# EAGLE design LM723 voltage regulator (EAGLE 9.4.2)
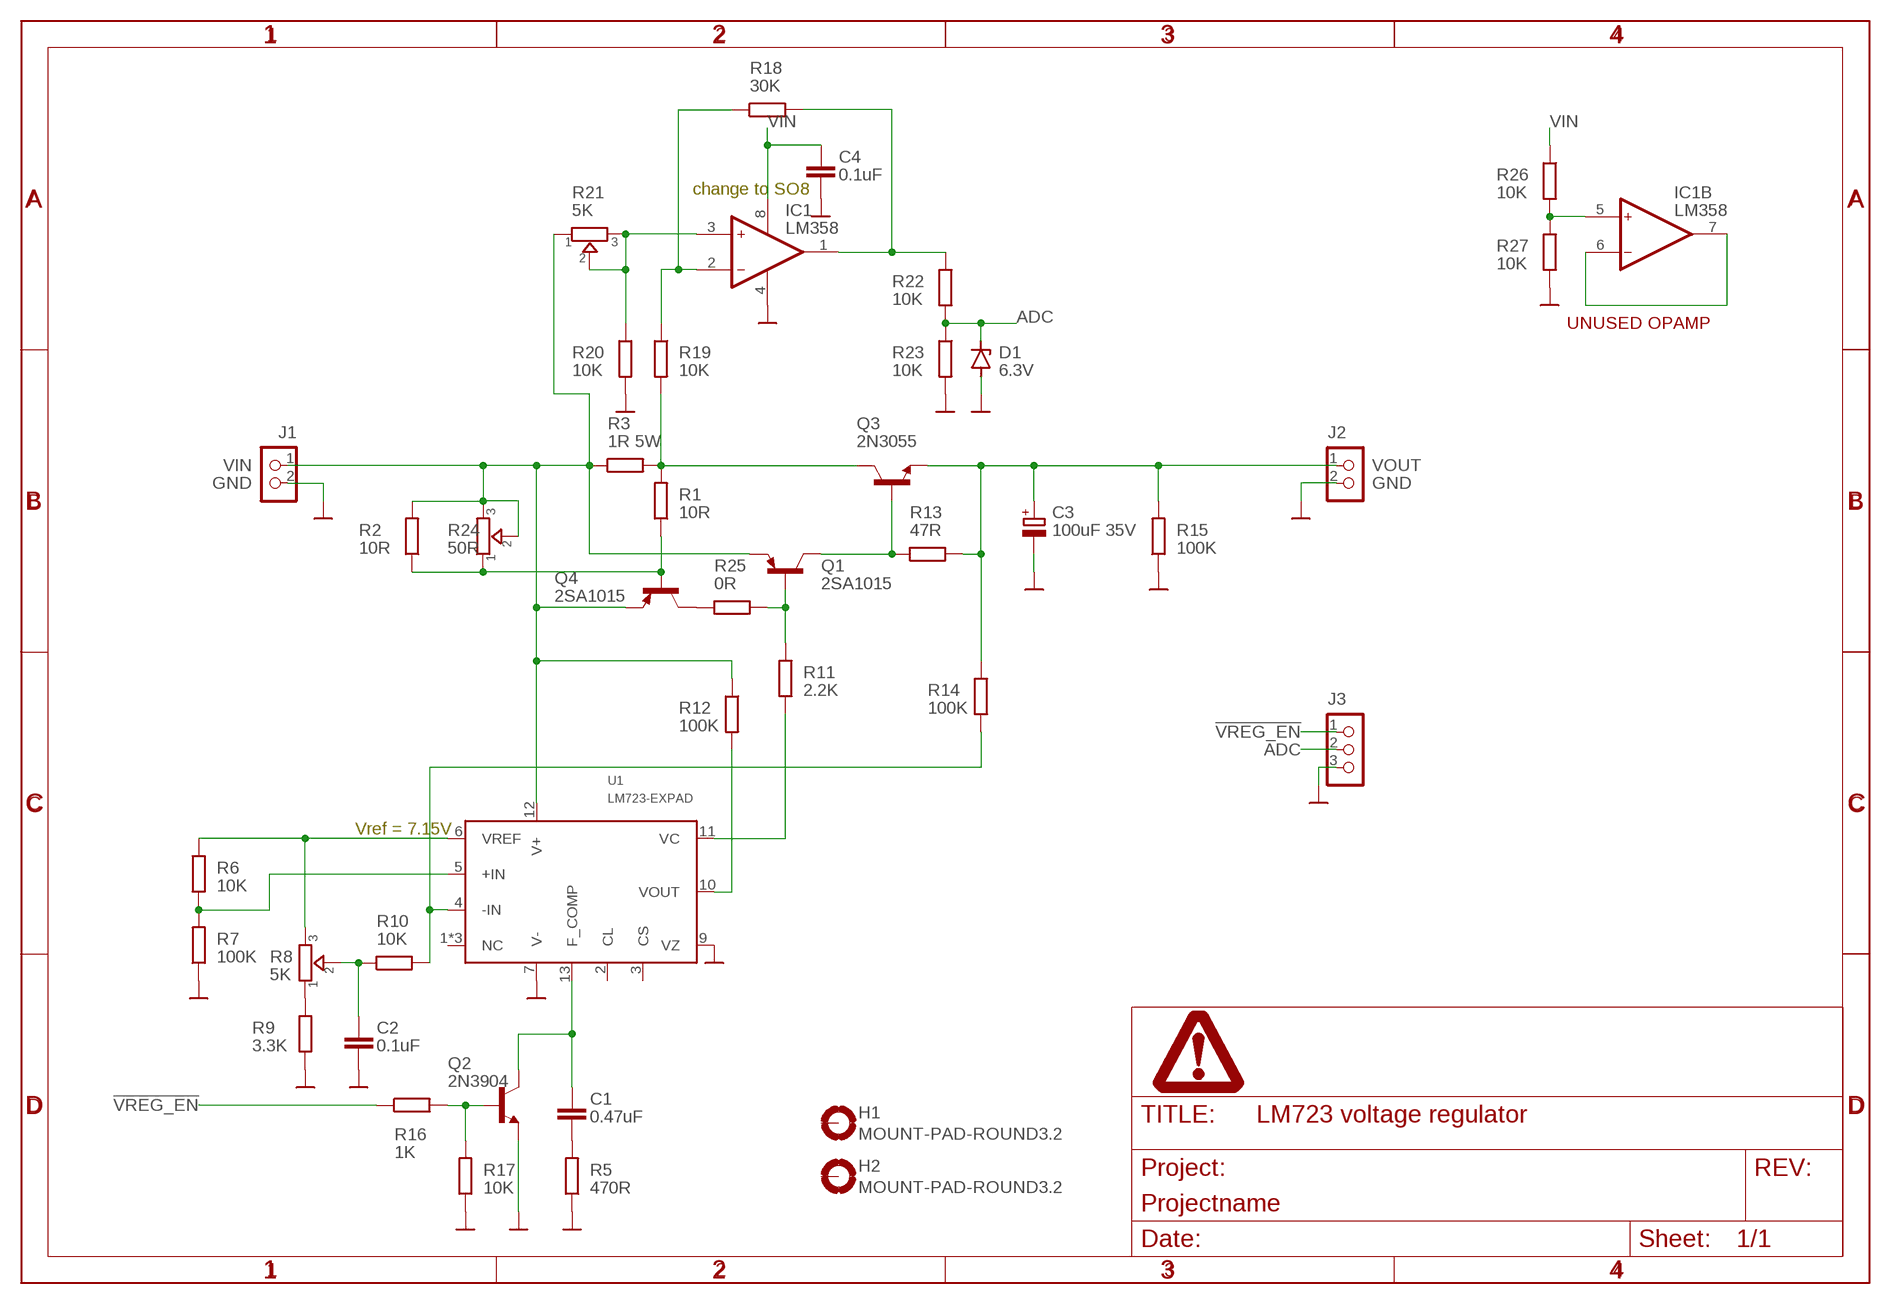
[diagram p0: schematic, sheet 1]

## Parts
C1  0.47uF  C-EU075-042X103  [C075-042X103]
C2  0.1uF  C-EU075-042X103  [C075-042X103]
C3  100uF 35V  CPOL-EUE2.5-7  [E2,5-7]
C4  0.1uF  C-EU075-042X103  [C075-042X103]
D1  6.3V  1N4728  [DO41Z10]
H1  MOUNT-PAD-ROUND3.2  [3,2-PAD]
H2  MOUNT-PAD-ROUND3.2  [3,2-PAD]
IC1  LM358  IC_OP-AMP_LM358-EXPAD  [DIP8-EXPAD]
J1  CON_TERMINAL_BLOCK_02-5MM  [TERMINAL_BLOCK_2P_5]
J2  CON_TERMINAL_BLOCK_02-5MM  [TERMINAL_BLOCK_2P_5]
J3  CON_HEADER_1X03-PTH  [M1X3]
PAGE1  FRAME_DINA4_L  [DP_LOGO]
Q1  2SA1015  TRANSISTOR_BJT_PNP-TO-92-ECB  [TO-92]
Q2  2N3904  TRANSISTOR_BJT_NPN-TO-92-EBC  [TO-92]
Q3  2N3055  [TO3]
Q4  2SA1015  TRANSISTOR_BJT_PNP-TO-92-ECB  [TO-92]
R1  10R  RESISTOR-V  [R_5V_EXPAD]
R2  10R  RESISTOR-V  [R_5V_EXPAD]
R3  1R 5W  RESISTOR-5W  [RESISTOR_5W]
R5  470R  RESISTOR-V  [R_5V_EXPAD]
R6  10K  RESISTOR-V  [R_5V_EXPAD]
R7  100K  RESISTOR-V  [R_5V_EXPAD]
R8  5K  TRIMMER-3362P_EXPAD  [TRIMMER_3362P_EXPAD]
R9  3.3K  RESISTOR-V  [R_5V_EXPAD]
R10  10K  R-EU_0207/12  [0207/12]
R11  2.2K  RESISTOR-V  [R_5V_EXPAD]
R12  100K  RESISTOR-V  [R_5V_EXPAD]
R13  47R  RESISTOR-V  [R_5V_EXPAD]
R14  100K  RESISTOR-V  [R_5V_EXPAD]
R15  100K  RESISTOR-V  [R_5V_EXPAD]
R16  1K  RESISTOR  [R-5_EXPAD]
R17  10K  RESISTOR-V  [R_5V_EXPAD]
R18  30K  RESISTOR-V  [R_5V_EXPAD]
R19  10K  RESISTOR-V  [R_5V_EXPAD]
R20  10K  RESISTOR-V  [R_5V_EXPAD]
R21  5K  TRIMMER-3362P_EXPAD  [TRIMMER_3362P_EXPAD]
R22  10K  RESISTOR-V  [R_5V_EXPAD]
R23  10K  RESISTOR-V  [R_5V_EXPAD]
R24  50R  TRIMMER-3362P_EXPAD  [TRIMMER_3362P_EXPAD]
R25  0R  RESISTOR-V  [R_5V_EXPAD]
R26  10K  RESISTOR-V  [R_5V_EXPAD]
R27  10K  RESISTOR-V  [R_5V_EXPAD]
U1  LM723-EXPAD  [DIP14-EXPAD]

## Nets
!VREG_EN: J3.1 R16.1
ADC: D1.C J3.2 R22.2 R23.1
GND: C2.2 C3.- C4.2 D1.A IC1.4(V-) J1.2 J2.2 J3.3 Q2.1(E) R5.1 R7.1 R9.1 R15.1 R17.1 R20.2 R23.2 R27.2 U1.7(V-) U1.9(VZ) ; supply symbol labelled SUPPLY_GND
N$1: Q3.C Q3.C/(C) R1.2 R3.2 R19.2
N$2: Q4.3(B) R1.1 R2.1 R24.1
N$3: Q1.2(C) Q3.B R13.1
N$4: IC1.2(-) R18.1 R19.1
N$6: C1.2 R5.2
N$7: C1.1 Q2.3(C) U1.13(F_COMP)
N$8: R6.1 R7.2 U1.5(+IN)
N$9: R6.2 R8.3 U1.6(VREF)
N$10: R8.1 R9.2
N$11: C2.1 R8.2 R10.1
N$12: R10.2 R14.2 U1.4(-IN)
N$13: Q1.3(B) R11.2 R25.1
N$14: R11.1 U1.11(VC)
N$15: R12.2 U1.10(VOUT)
N$16: IC1.3(+) R20.1 R21.2 R21.3
N$17: Q2.2(B) R16.2 R17.2
N$18: IC1.1(OUT) R18.2 R22.1
N$19: Q4.2(C) R25.2
N$20: IC1.6(-) IC1.7(OUT)
N$21: IC1.5(+) R26.2 R27.1
VIN: C4.1 IC1.8(V+) J1.1 Q1.1(E) Q4.1(E) R2.2 R3.1 R12.1 R21.1 R24.2 R24.3 R26.1 U1.12(V+)
VOUT: C3.+ J2.1 Q3.E R13.2 R14.1 R15.2
Unconnected: H1.B3,2(MOUNT) H2.B3,2(MOUNT) U1.1(NC) U1.2(CL) U1.3(CS) U1.8(NC) U1.14(NC)

## Notes on the sheet
- change to SO8
- UNUSED OPAMP
- Vref = 7.15V

## Library data of the parts
C1 C2 C4 = rcl:C-EU: CAPACITOR, European symbol; SPICEPREFIX: C
C3 = rcl:CPOL-EU: POLARIZED CAPACITOR, European symbol; SPICEPREFIX: C
D1 = diode:1N4728: Z DIODE 3.3 V, 1W, 5 percent
H1 H2 = holes:MOUNT-PAD-ROUND: MOUNTING PAD, round
IC1 = trosh_devices.eagle.v9:IC_OP-AMP_LM358: Dual op-amp
J1 J2 = dp_devices.v6:CON_TERMINAL_BLOCK_02: 2 poles wire to board terminal block
J3 = dp_devices.v6:CON_HEADER_1X03
PAGE1 = dp_devices.v6:FRAME_DINA4_L: A4 DP frame Standard Dangerous Prototypes schematic frame. Automagically adds the DP logo and standard texts to the PCB Use the atrribute in the schematic editor to change the fields.; PROJECT: Projectname
Q1 Q4 = dp_devices.v6:TRANSISTOR_BJT_PNP: Most commonly used is SOT23-BEC
Q2 = dp_devices.v6:TRANSISTOR_BJT_NPN: Most commonly used is SOT23-BEC
Q3 = transistor-npn:2N3055: NPN Transistor
R1 R2 R5-R7 R9 R11-R20 R22 R23 R25-R27 = trosh_devices.eagle.v9:RESISTOR
R3 = trosh_devices.eagle.v9:RESISTOR-5W: 22 x 9.5 mm cement resistor
R8 R21 R24 = trosh_devices.eagle.v9:TRIMMER: Trimmer resistor
R10 = rcl:R-EU_: RESISTOR, European symbol; SPICEPREFIX: R
U1 = trosh_devices.eagle.v9:LM723: LM723 Voltage Regulator

## Board
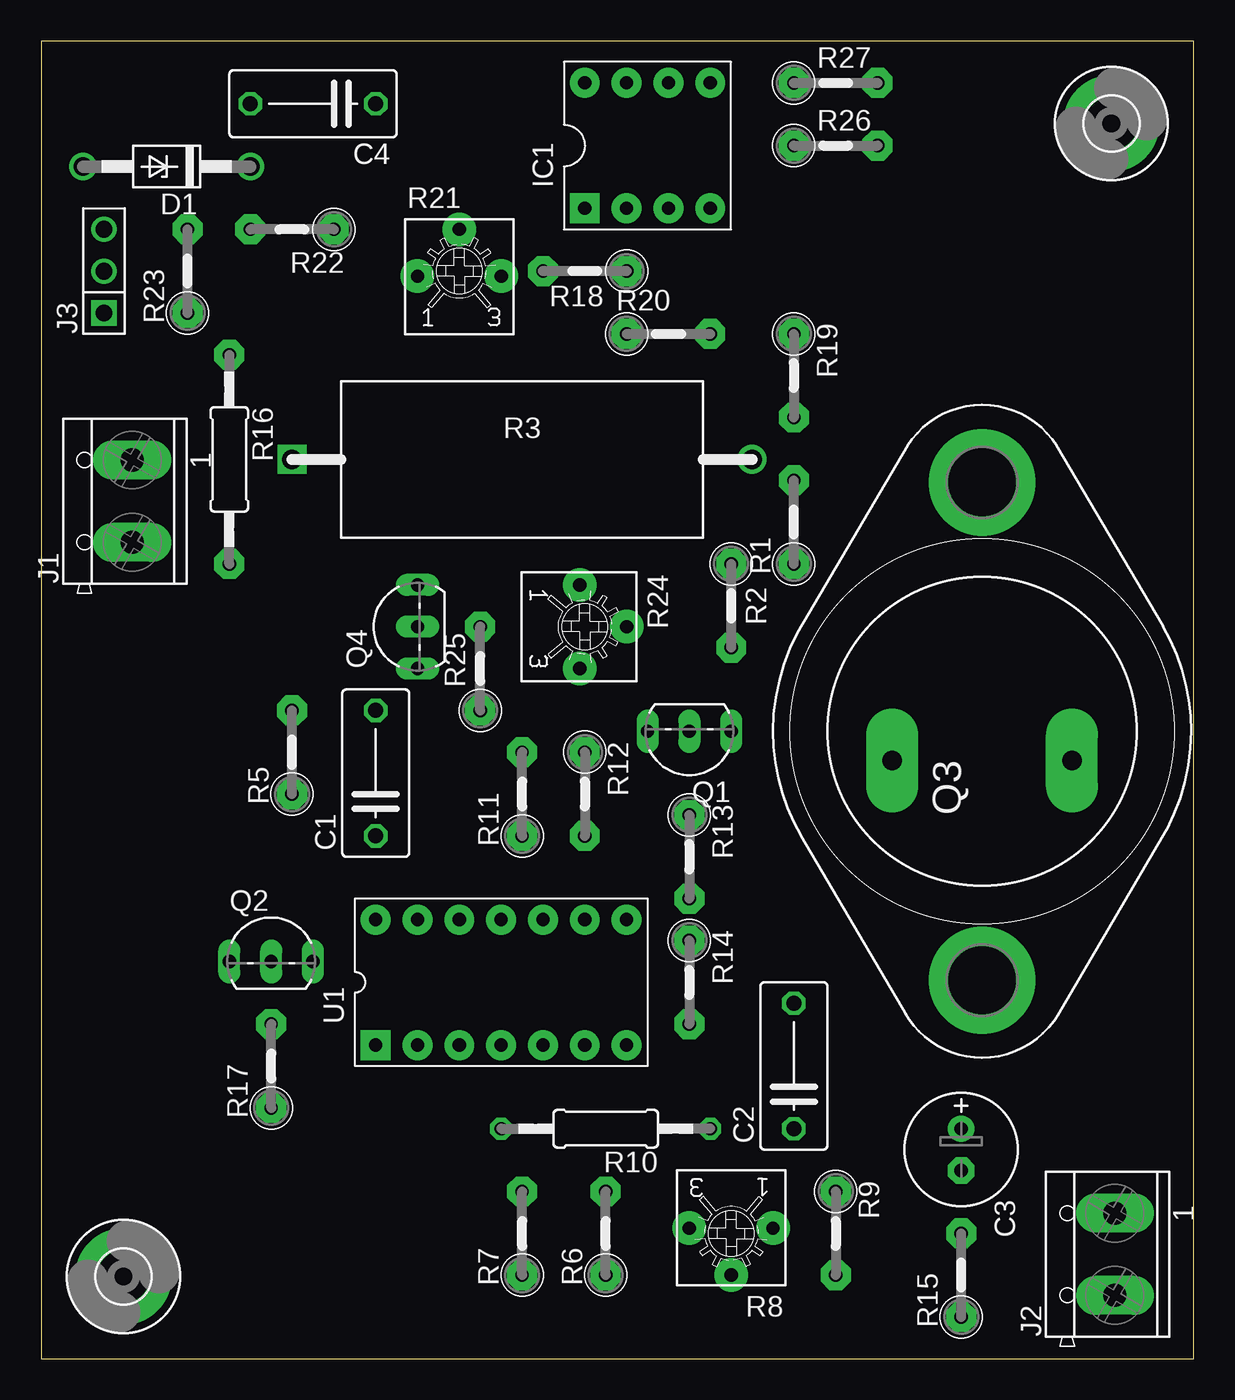
[diagram p1: board, top side]
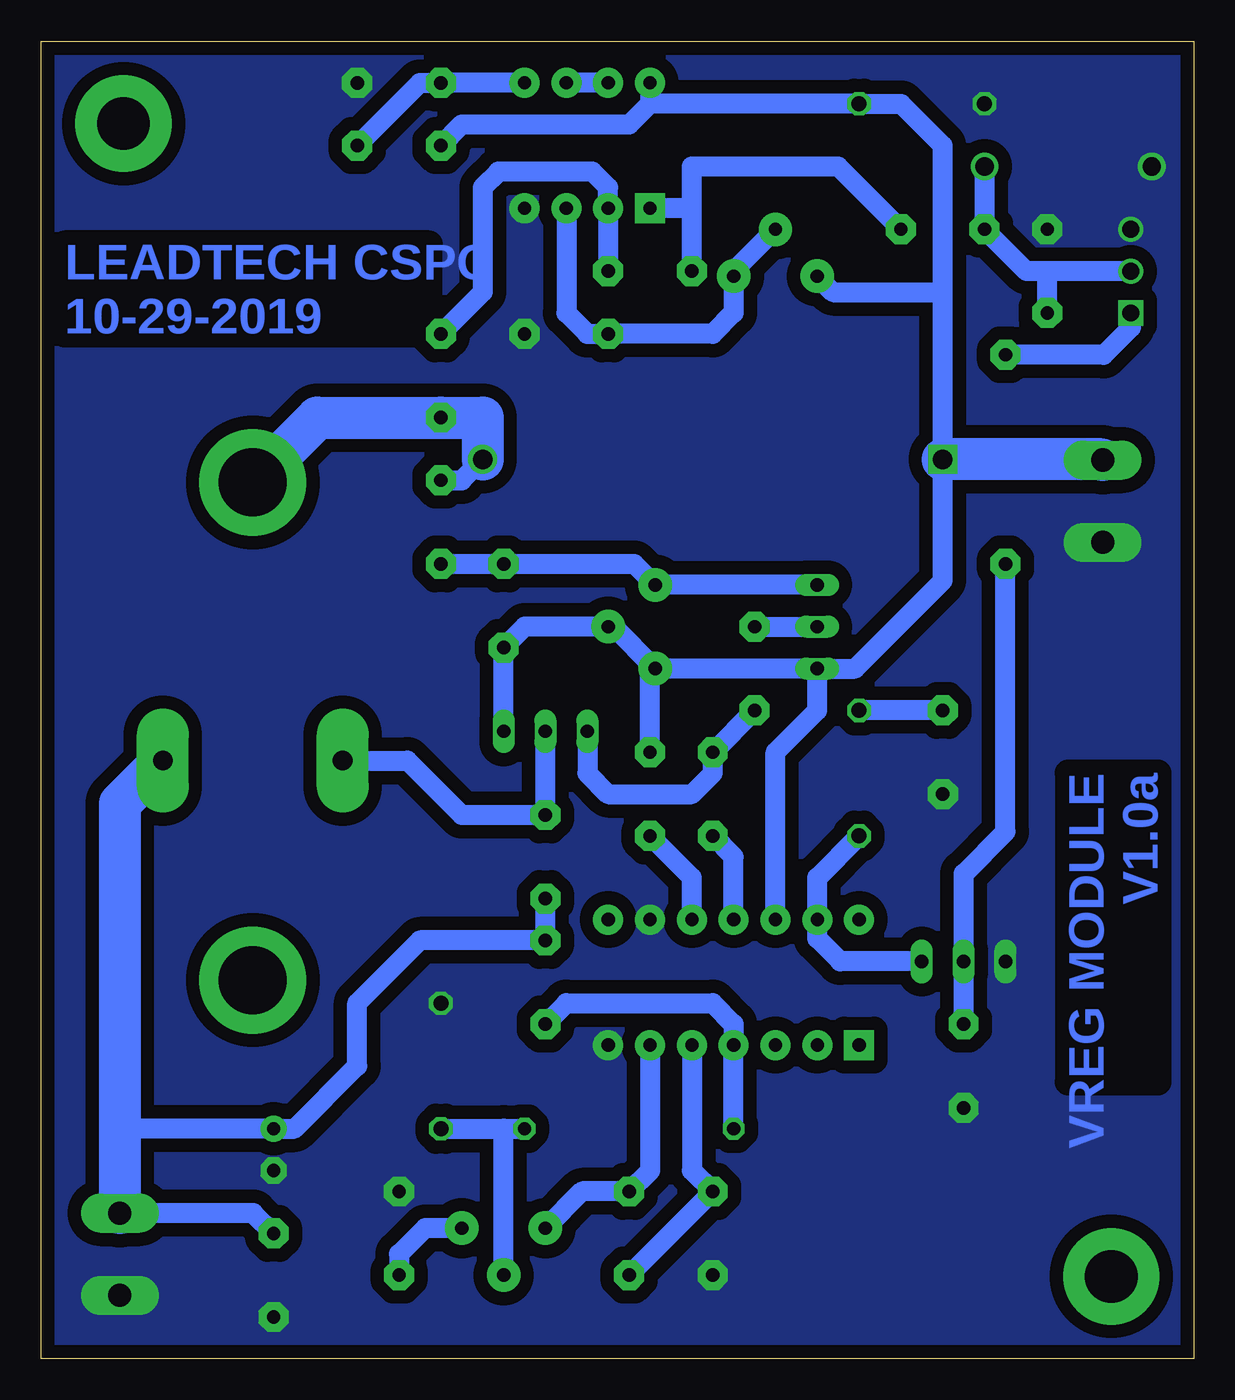
[diagram p2: board, bottom side, seen from below]

Size 70 x 80 mm. Coordinates in mm from the lower left corner, seen from the top.
Outline: 0,0 70,0 70,80 0,80 0,0
Copper layers (1*16): Top 0.035mm / dielectric 1.5mm / Bottom 0.035mm
Design rules "dirt_cheap_dirty_boards.v1.1": minimum track width 6mil, minimum drill 12mil, track to track 6mil, track to pad 6mil, pad to pad 6mil, via to via 6mil, smd to smd 0mil, copper to edge 10mil, drill to drill 10mil, minimum pad ring 10mil, minimum via ring 6mil, stop-mask expansion 2mil, vias tented up to drill 25mil, thermal gap 10mil

### Footprints (pad centres in the part's own frame; a part is rotated, then mirrored left to right if it is on the bottom)
C075-042X103 = drill 0.914 octagon: 1 -3.81,0; 2 3.81,0
E2,5-7 = drill 0.813 pad 1.6: + -1.27,0 | drill 0.813 pad 1.6 octagon: - 1.27,0
DO41Z10 = drill 1.118: A 5.08,0; C -5.08,0
3,2-PAD = drill 3.2 pad 5.842: B3,2 0,0
DIP8-EXPAD = drill 0.8 pad 1.816 square: 1 -3.81,-3.81 | drill 0.8 pad 1.816: 2 -1.27,-3.81; 3 1.27,-3.81; 4 3.81,-3.81; 5 3.81,3.81; 6 1.27,3.81; 7 -1.27,3.81; 8 -3.81,3.81
TERMINAL_BLOCK_2P_5 = drill 1.4 pad 2.38 long: 1 2.5,-0.45; 2 -2.5,-0.45
M1X3 = drill 1.02 square: 1 0,0 | drill 1.02: 2 2.54,0; 3 5.08,0
TO-92 = drill 0.813 long: 1 -2.54,0; 2 0,0; 3 2.54,0
TO3 = drill 1.194 pad 3.15 long: B -1.778,5.461; E -1.778,-5.461 | drill 4.115 pad 6.477: C 15.113,0; C/ -15.113,0
R_5V_EXPAD = drill 0.813 pad 1.816 octagon: 1 -2.54,0; 2 2.54,0
RESISTOR_5W = drill 1.18 square: 1 -13.97,0 | drill 1.18: 2 13.97,0
TRIMMER_3362P_EXPAD = drill 0.813 pad 2.032: 1 -2.54,-0.31; 2 0,2.54; 3 2.54,-0.31
0207/12 = drill 0.813 octagon: 1 -6.35,0; 2 6.35,0
R-5_EXPAD = drill 0.813 pad 1.816 octagon: 1 -6.35,0; 2 6.35,0
DIP14-EXPAD = drill 0.8 pad 1.816 square: 1 -7.62,-3.81 | drill 0.8 pad 1.816: 2 -5.08,-3.81; 3 -2.54,-3.81; 4 0,-3.81; 5 2.54,-3.81; 6 5.08,-3.81; 7 7.62,-3.81; 8 7.62,3.81; 9 5.08,3.81; 10 2.54,3.81; 11 0,3.81; 12 -2.54,3.81; 13 -5.08,3.81; 14 -7.62,3.81

### Placement (x,y rotation side)
C1  20.32,35.56 90 top
C2  45.72,17.78 90 top
C3  55.88,12.7 270 top
C4  16.51,76.2 180 top
D1  7.62,72.39 180 top
H1  5,5 0 top
H2  65,75 0 top
IC1  36.83,73.66 0 top
J1  5.08,52.07 90 top
J2  64.77,6.35 90 top
J3  3.81,63.5 90 top
PAGE1  1.27,-5.08 0 top  (outside the outline)
Q1  39.37,38.1 180 top
Q2  13.97,24.13 0 top
Q3  57.15,38.1 90 top
Q4  22.86,44.45 90 top
R1  45.72,50.8 90 top
R2  41.91,45.72 270 top
R3  29.21,54.61 0 top
R5  15.24,36.83 90 top
R6  34.29,7.62 90 top
R7  29.21,7.62 90 top
R8  41.91,7.62 180 top
R9  48.26,7.62 270 top
R10  34.29,13.97 180 top
R11  29.21,34.29 90 top
R12  33.02,34.29 270 top
R13  39.37,30.48 270 top
R14  39.37,22.86 270 top
R15  55.88,5.08 90 top
R16  11.43,54.61 270 top
R17  13.97,17.78 90 top
R18  33.02,66.04 180 top
R19  45.72,59.69 270 top
R20  38.1,62.23 0 top
R21  25.4,66.04 0 top
R22  15.24,68.58 180 top
R23  8.89,66.04 90 top
R24  33.02,44.45 270 top
R25  26.67,41.91 90 top
R26  48.26,73.66 0 top
R27  48.26,77.47 0 top
U1  27.94,22.86 0 top

### Tracks (layer width: path | path; a pad name or v marks a point on that pad's centre or on a via)
!VREG_EN
  Bottom 1.219: J3.1 3.81,62.61 5.46,60.96 R16.1
ADC
  Bottom 1.219: D1.C R22.2 10.16,66.04 8.89,66.04 | J3.2 8.89,66.04 | R23.1 8.89,66.04
GND
  pour Bottom (isolate 0.813, rank 6, no thermals): 0,80 70,80 70,0 0,0
N$1
  Bottom 1.219: R1.2 44.45,53.34 R3.2
  Bottom 2.54: Q3.C 53.21,57.15 R19.2 43.18,57.15 R3.2
N$2
  Bottom 1.219: Q4.3 R24.1 33.98,48.26 R2.1 R1.1
N$3
  Bottom 1.219: Q1.2 R13.1 44.45,33.02 47.75,36.32 Q3.B
N$4
  Bottom 1.219: R18.1 IC1.2 35.56,71.12 36.51,72.07 42.23,72.07 43.18,71.12 43.18,64.77 R19.1
N$6
  Bottom 1.219: R5.2 C1.2
N$7
  Bottom 1.219: C1.1 22.86,29.21 U1.13 22.86,25.53 21.46,24.13 Q2.3
N$8
  Bottom 1.219: U1.5 30.48,11.43 R7.2 R6.1
N$9
  Bottom 1.219: U1.6 33.02,11.43 R6.2 37.14,10.16 R8.3
N$10
  Bottom 1.219: R8.1 46.68,7.93 48.26,6.35 R9.2
N$11
  Bottom 1.219: C2.1 41.91,13.97 | 41.91,13.97 R10.1 | R8.2 41.91,13.97
N$12
  Bottom 1.219: R10.2 U1.4 27.94,20.32 29.21,21.59 38.1,21.59 R14.2
N$13
  Bottom 1.219: Q1.3 36.83,35.56 35.56,34.29 30.48,34.29 29.21,35.56 R11.2 R25.1
N$14
  Bottom 1.219: U1.11 27.94,30.48 R11.1
N$15
  Bottom 1.219: U1.10 30.48,29.21 R12.2
N$16
  Bottom 1.219: R21.2 27.94,66.04 R21.3 27.94,63.5 29.21,62.23 R20.1 36.83,62.23 38.1,63.5 IC1.3
N$17
  Bottom 1.219: R17.2 Q2.2 13.97,29.46 11.43,32 R16.2
N$18
  Bottom 1.219: R22.1 21.59,72.39 30.48,72.39 30.48,69.85 | 30.48,69.85 IC1.1 | R18.2 30.48,69.85
N$19
  Bottom 1.219: R25.2 Q4.2
N$20
  Bottom 1.219: IC1.7 IC1.6
N$21
  Bottom 1.219: IC1.5 R27.1 46.99,77.47 R26.2
VIN
  Bottom 1.219: Q4.1 22.86,39.37 25.4,36.83 U1.12 | R24.3 35.25,44.45 R24.2 40.64,44.45 R2.2 Q1.1 | 15.24,64.77 15.24,73.66 17.78,76.2 C4.1 33.02,76.2 | Q4.1 20.57,41.91 15.24,47.24 R3.1 15.24,64.77 | R12.1 33.02,41.6 R24.3 | Q4.1 R24.3 | R21.1 21.9,64.77 15.24,64.77 | IC1.8 33.02,76.2 | 33.02,76.2 34.29,74.93 44.45,74.93 R26.1
  Bottom 2.54: J1.1 5.57,54.61 R3.1
VOUT
  Bottom 1.219: R13.2 R14.1 46.99,25.4 50.8,21.59 50.8,17.78 54.61,13.97 C3.+ 65.22,13.97 | R15.2 57.11,8.85 J2.1
  Bottom 2.54: Q3.E 65.22,33.71 65.22,13.97 J2.1

### Text on the board
Bottom: LEADTECH CSPG / 10-29-2019 | VREG MODULE / V1.0a